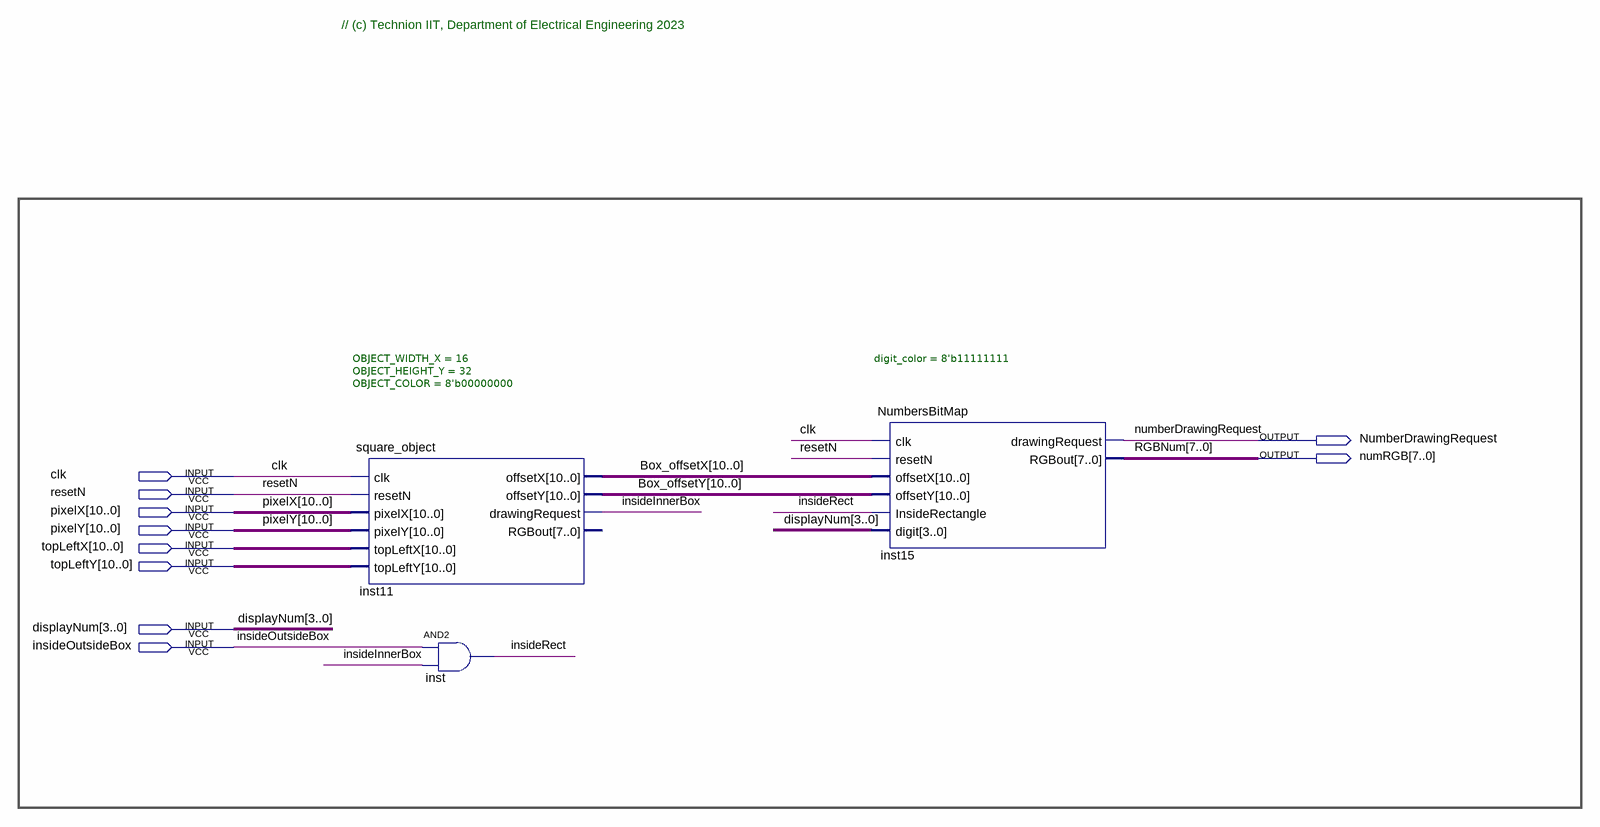
[diagram p0: schematic sheet]
// Quartus schematic NUMBER_DISPLAY.bdf as structural Verilog: 3 symbols, 10 pins
module NUMBER_DISPLAY (
  input  clk,
  input  resetN,
  input  [10:0] pixelX,
  input  [10:0] pixelY,
  input  [10:0] topLeftX,
  input  [10:0] topLeftY,
  input  [3:0] displayNum,
  input  insideOutsideBox,
  output NumberDrawingRequest,
  output [7:0] numRGB
);

  wire insideInnerBox, insideRect;
  wire [10:0] Box_offsetX, Box_offsetY;

  square_object #(.OBJECT_WIDTH_X(16), .OBJECT_HEIGHT_Y(32), .OBJECT_COLOR(8'b00000000)) inst11 (
    .clk(clk), .resetN(resetN), .pixelX(pixelX), .pixelY(pixelY), .topLeftX(topLeftX), .topLeftY(topLeftY),
    .offsetX(Box_offsetX), .offsetY(Box_offsetY), .drawingRequest(insideInnerBox));  // open: RGBout
  and inst (insideRect, insideOutsideBox, insideInnerBox);
  NumbersBitMap #(.digit_color(8'b11111111)) inst15 (
    .clk(clk), .resetN(resetN), .offsetX(Box_offsetX), .offsetY(Box_offsetY), .InsideRectangle(insideRect),
    .digit(displayNum), .drawingRequest(NumberDrawingRequest), .RGBout(numRGB));

  // Other names for the same wires on the sheet: RGBNum[7:0] = numRGB

  // Notes on the sheet:
  //   // (c) Technion IIT, Department of Electrical Engineering 2023
endmodule
